# Altium schematic sheet twoinone.SchDoc: Game
size A4; DrawnBy: Tim Johns
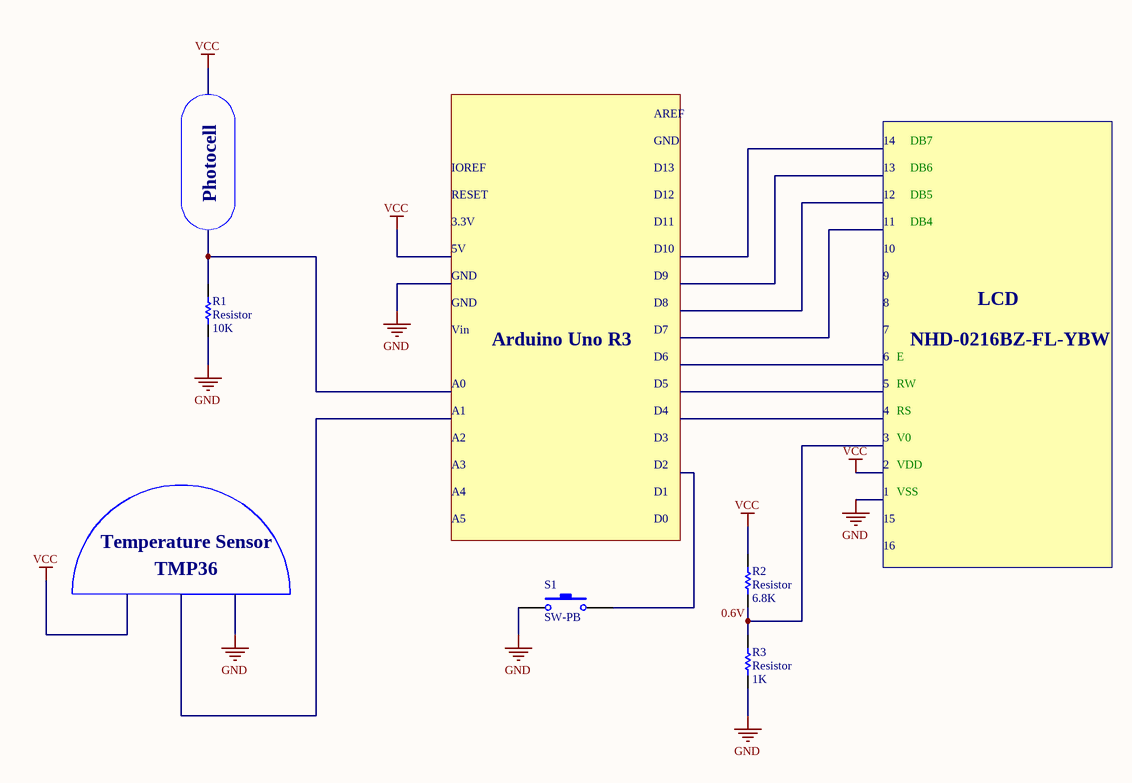
[diagram p0: twoinone.SchDoc]

## Parts
R1  Resistor  value 10K  [AXIAL-0.3]
R2  Resistor  value 6.8K  [AXIAL-0.3]
R3  Resistor  value 1K  [AXIAL-0.3]
S1  SW-PB  [SPST-2]

## Nets
GND: R1.1 R3.1 S1.1
VCC: R2.2
NetR2_1: R2.1 R3.2

Not connected (* = marked no-connect by the designer): R1 2; S1 2

## Notes on the sheet
- IOREF
- D13
- GND
- AREF
- 13
- 14
- DB6
- DB7
- Photocell
- 3.3V
- RESET
- D11
- D12
- 11
- 12
- DB4
- DB5
- 5V
- D8
- D9
- D10
- 8
- 9
- 10
- LCD
- Vin
- Arduino Uno R3
- D6
- D7
- 6
- 7
- E
- NHD-0216BZ-FL-YBW
- A0
- A1
- A2
- D3
- D4
- D5
- 3
- 4
- 5
- RS
- RW
- V0
- A3
- A4
- D1
- D2
- 1
- 2
- VDD
- VSS
- Temperature Sensor
- TMP36
- A5
- D0
- 15
- 16
- (near R2) 0.6V

## Library data of the parts
R1-R3 = Res1: Published: 8-Jun-2000; LatestRevisionDate: 17-Jul-2002; LatestRevisionNote: Re-released for DXP Platform.; PackageReference: AXIAL-0.3; Publisher: Altium Limited; PackageDescription: Axial Device, Thru-Hole; 2 Leads; 0.3 in Pin Spacing
S1 = SW-PB: Switch; Published: 24-Mar-1999; LatestRevisionDate: 17-Jul-2002; LatestRevisionNote: Re-released for DXP Platform.; PackageReference: SPST-2; Publisher: Altium Limited; PackageDescription: Switch; 2 Leads